# EAGLE design PIC32 (EAGLE 5.12)
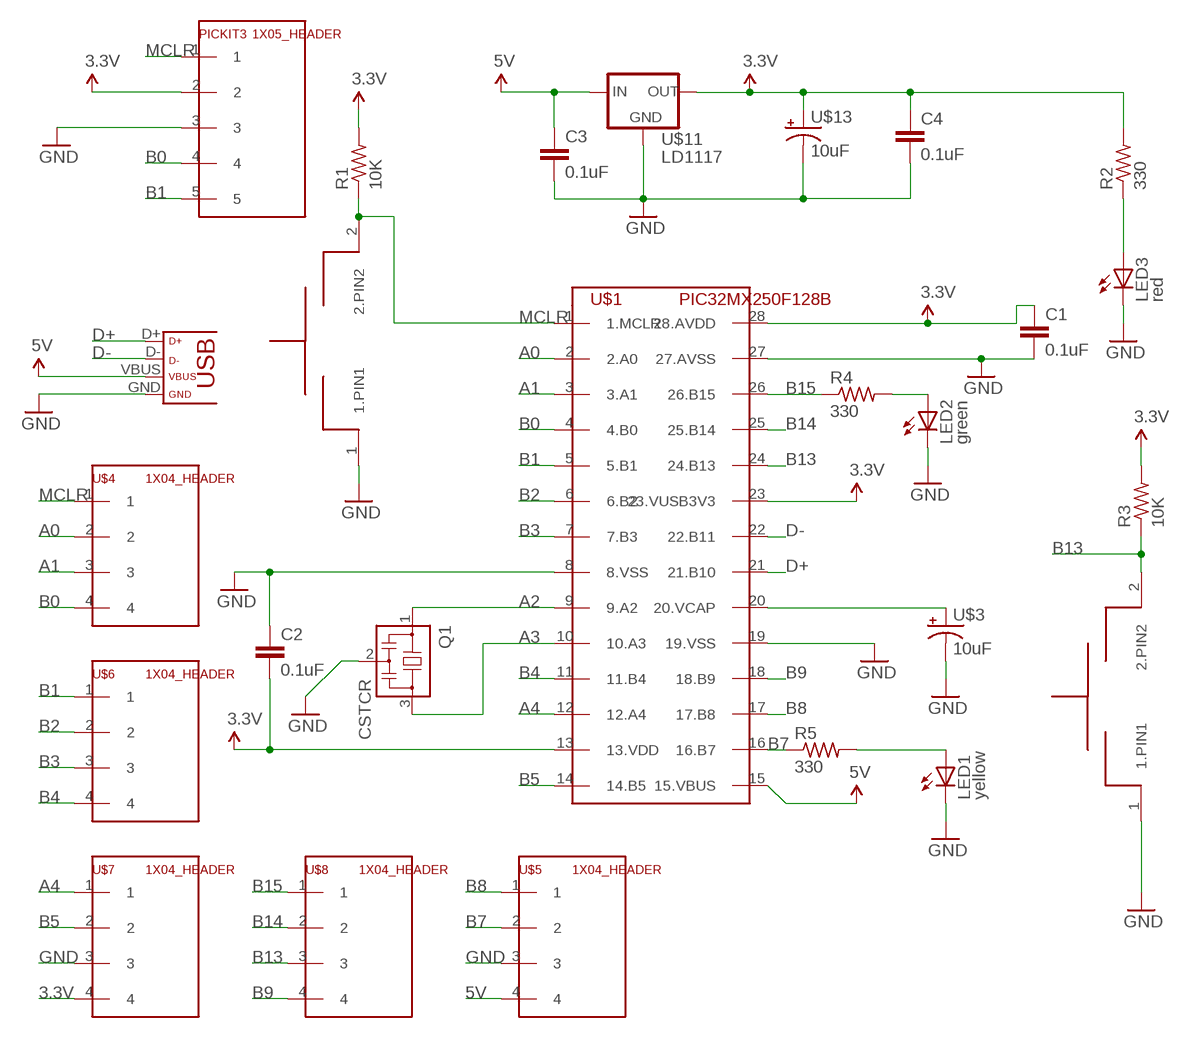
[diagram p0: schematic, sheet 1]

## Parts
C1  0.1uF  C-EU025-030X050  [C025-030X050]
C2  0.1uF  C-EU025-030X050  [C025-030X050]
C3  0.1uF  C-EU025-030X050  [C025-030X050]
C4  0.1uF  C-EU025-030X050  [C025-030X050]
LED1  yellow  LED3MM  [LED3MM]
LED2  green  LED3MM  [LED3MM]
LED3  red  LED3MM  [LED3MM]
PICKIT3  1X05_HEADER  [1X05]
Q1  CSTCR  [RESONATOR]
R1  10K  R-US_0309/12  [0309/12]
R2  330  R-US_0309/12  [0309/12]
R3  10K  R-US_0309/12  [0309/12]
R4  330  R-US_0309/12  [0309/12]
R5  330  R-US_0309/12  [0309/12]
U$1  PIC32MX250F128B  [DIL28-3]
U$3  10uF  CAP_POL  [CAP_POL_D]
U$4  1X04_HEADER  [1X04]
U$5  1X04_HEADER  [1X04]
U$6  1X04_HEADER  [1X04]
U$7  1X04_HEADER  [1X04]
U$8  1X04_HEADER  [1X04]
U$9  USB  [USB-MINIB]
U$11  LD1117  [TO220]
U$13  10uF  CAP_POL  [CAP_POL_D]
U$14  BUTTON  [BUTTON]
U$15  BUTTON  [BUTTON]

## Nets
3.3V: C1.1 C2.2 C4.1 PICKIT3.2 R1.2 R2.2 R3.2 U$1.13(13.VDD) U$1.23(23.VUSB3V3) U$1.28(28.AVDD) U$7.4 U$11.2(OUT) U$13.1(+)
5V: C3.1 U$1.15(15.VBUS) U$5.4 U$9.VBUS U$11.3(IN)
A0: U$1.2(2.A0) U$4.2
A1: U$1.3(3.A1) U$4.3
A2: Q1.1 U$1.9(9.A2)
A3: Q1.3 U$1.10(10.A3)
A4: U$1.12(12.A4) U$7.1
B0: PICKIT3.4 U$1.4(4.B0) U$4.4
B1: PICKIT3.5 U$1.5(5.B1) U$6.1
B2: U$1.6(6.B2) U$6.2
B3: U$1.7(7.B3) U$6.3
B4: U$1.11(11.B4) U$6.4
B5: U$1.14(14.B5) U$7.2
B7: R5.1 U$1.16(16.B7) U$5.2
B8: U$1.17(17.B8) U$5.1
B9: U$1.18(18.B9) U$8.4
B13: R3.1 U$1.24(24.B13) U$8.3 U$15.2(2.PIN2)
B14: U$1.25(25.B14) U$8.2
B15: R4.1 U$1.26(26.B15) U$8.1
D+: U$1.21(21.B10) U$9.D+
D-: U$1.22(22.B11) U$9.D-
GND: C1.2 C2.1 C3.2 C4.2 LED1.K(C) LED2.K(C) LED3.K(C) PICKIT3.3 Q1.2 U$1.8(8.VSS) U$1.19(19.VSS) U$1.27(27.AVSS) U$3.2(-) U$5.3 U$7.3 U$9.GND U$11.1(GND) U$13.2(-) U$14.1(1.PIN1) U$15.1(1.PIN1)
MCLR: PICKIT3.1 R1.1 U$1.1(1.MCLR) U$4.1 U$14.2(2.PIN2)
N$2: LED1.A R5.2
N$4: LED2.A R4.2
N$5: U$1.20(20.VCAP) U$3.1(+)
N$6: LED3.A R2.1

## Library data of the parts
C1-C4 = ME433:C-EU: CAPACITOR, European symbol
LED1-LED3 = led:LED: LED OSRAM: - CHIPLED LG R971, LG N971, LY N971, LG Q971, LY Q971, LO R971, LY R971 LH N974, LH R974 LS Q976, LO Q976, LY Q976 LO Q996 - Hyper CHIPLED LW Q18S LB Q993, LB Q99A, LB R99A - SideLED LS A670, LO A670, LY A670, LG A670, LP A670 LB A673, LV A673, LT A673, LW A673 LH A674 LY A675 LS A676, LA A676, LO A676, LY A676, LW A676 LS A679, LY A679, LG A679 - Hyper Micro SIDELED® LS Y876, LA Y876, LO Y876, LY Y876 LT Y87S - SmartLED LW L88C, LW L88S LB L89C, LB L89S, LG L890 LS L89K, LO L89K, LY L89K LS L896, LA L896, LO L896, LY L896 - TOPLED LS T670, LO T670, LY T670, LG T670, LP T670 LSG T670, LSP T670, LSY T670, LOP T670, LYG T670 LG T671, LOG T671, LSG T671 LB T673, LV T673, LT T673, LW T673 LH T674 LS T676, LA T676, LO T676, LY T676, LB T676, LH T676, LSB T676, LW T676 LB T67C, LV T67C, LT T67C, LS T67K, LO T67K, LY T67K, LW E67C LS E67B, LA E67B, LO E67B, LY E67B, LB E67C, LV E67C, LT E67C LW T67C LS T679, LY T679, LG T679 LS T770, LO T770, LY T770, LG T770, LP T770 LB T773, LV T773, LT T773, LW T773 LH T774 LS E675, LA E675, LY E675, LS T675 LS T776, LA T776, LO T776, LY T776, LB T776 LHGB T686 LT T68C, LB T68C - Hyper Mini TOPLED® LB M676 - Mini TOPLED Santana® LG M470 LS M47K, LO M47K, LY M47K Source: http://www.osram.convergy.de LUXEON: - LUMILED® LXK2-PW12-R00, LXK2-PW12-S00, LXK2-PW14-U00, LXK2-PW14-V00 LXK2-PM12-R00, LXK2-PM12-S00, LXK2-PM14-U00 LXK2-PE12-Q00, LXK2-PE12-R00, LXK2-PE12-S00, LXK2-PE14-T00, LXK2-PE14-U00 LXK2-PB12-K00, LXK2-PB12-L00, LXK2-PB12-M00, LXK2-PB14-N00, LXK2-PB14-P00, LXK2-PB14-Q00 LXK2-PR12-L00, LXK2-PR12-M00, LXK2-PR14-Q00, LXK2-PR14-R00 LXK2-PD12-Q00, LXK2-PD12-R00, LXK2-PD12-S00 LXK2-PH12-R00, LXK2-PH12-S00 LXK2-PL12-P00, LXK2-PL12-Q00, LXK2-PL12-R00 Source: www.luxeon.com KINGBRIGHT: KA-3528ASYC Source: www.kingbright.com
PICKIT3 = ME433:1X05_HEADER
Q1 = ME433:CSTCR: Resonator Source: murata.co.jp
R1-R5 = ME433:R-US_: RESISTOR, American symbol
U$1 = ME433:PIC32MX250F128B
U$3 U$13 = ME433:CAP_POL
U$4-U$8 = ME433:1X04_HEADER
U$9 = ME433:USB
U$11 = ME433:LD1117
U$14 U$15 = ME433:BUTTON

## Board
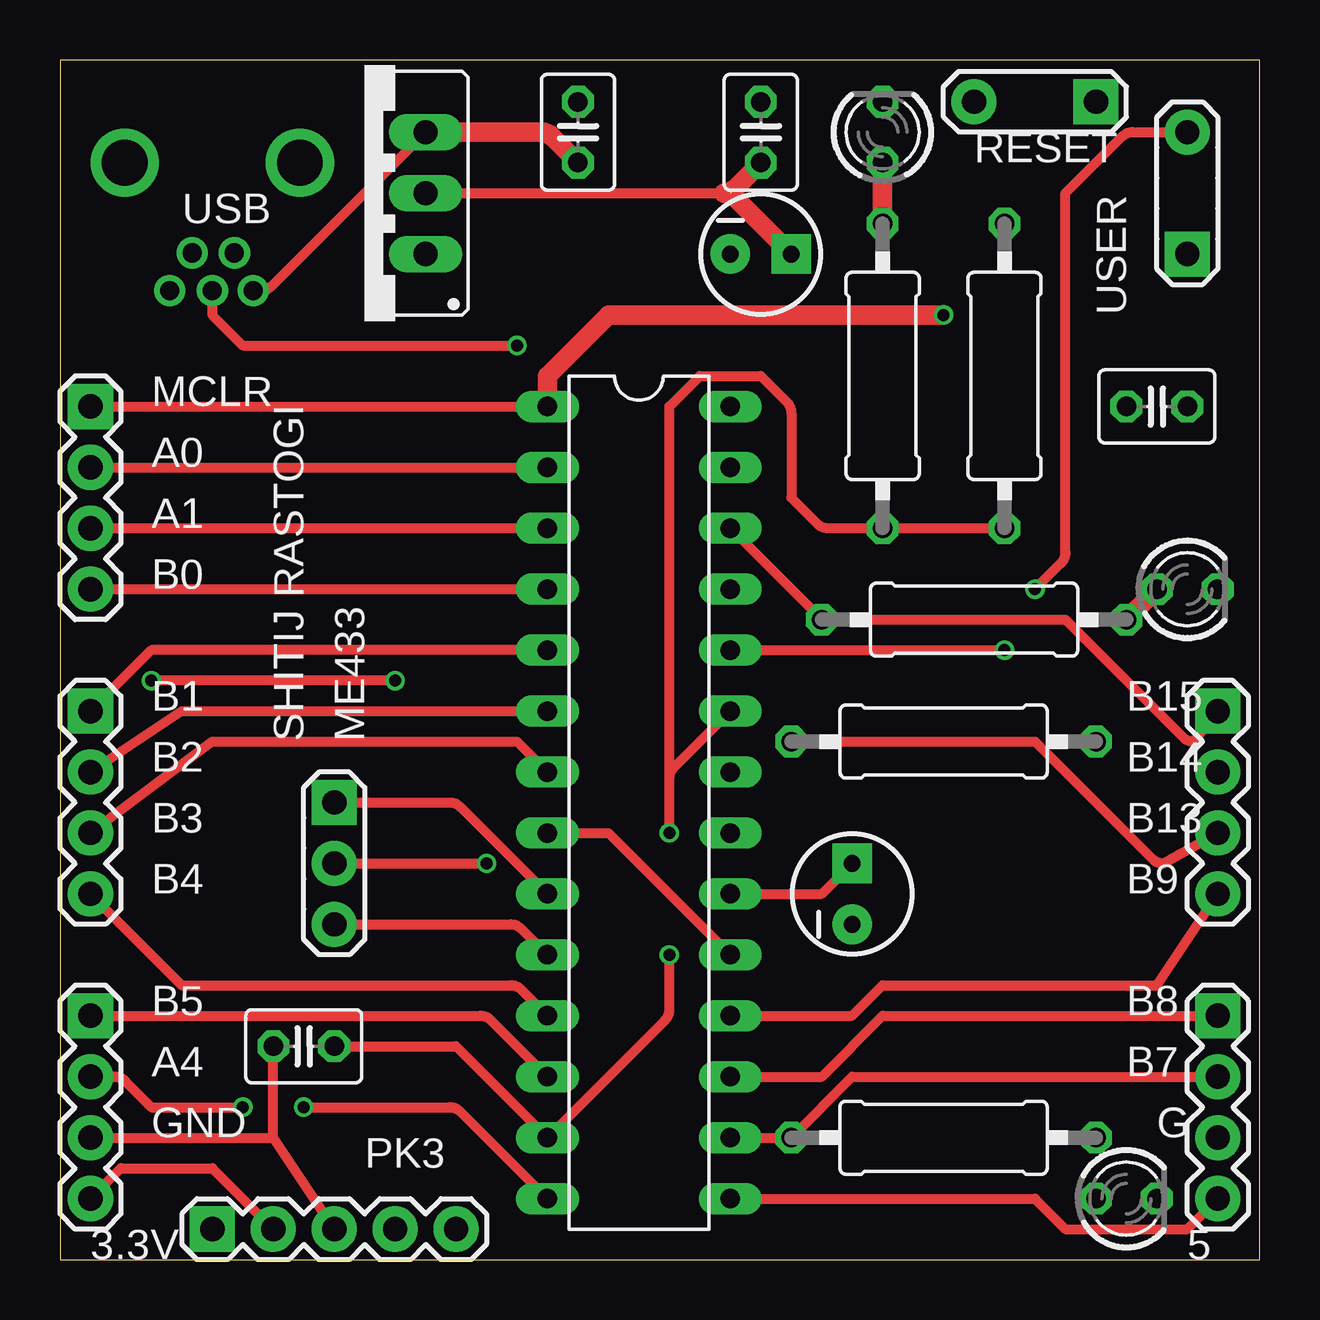
[diagram p1: board, top side]
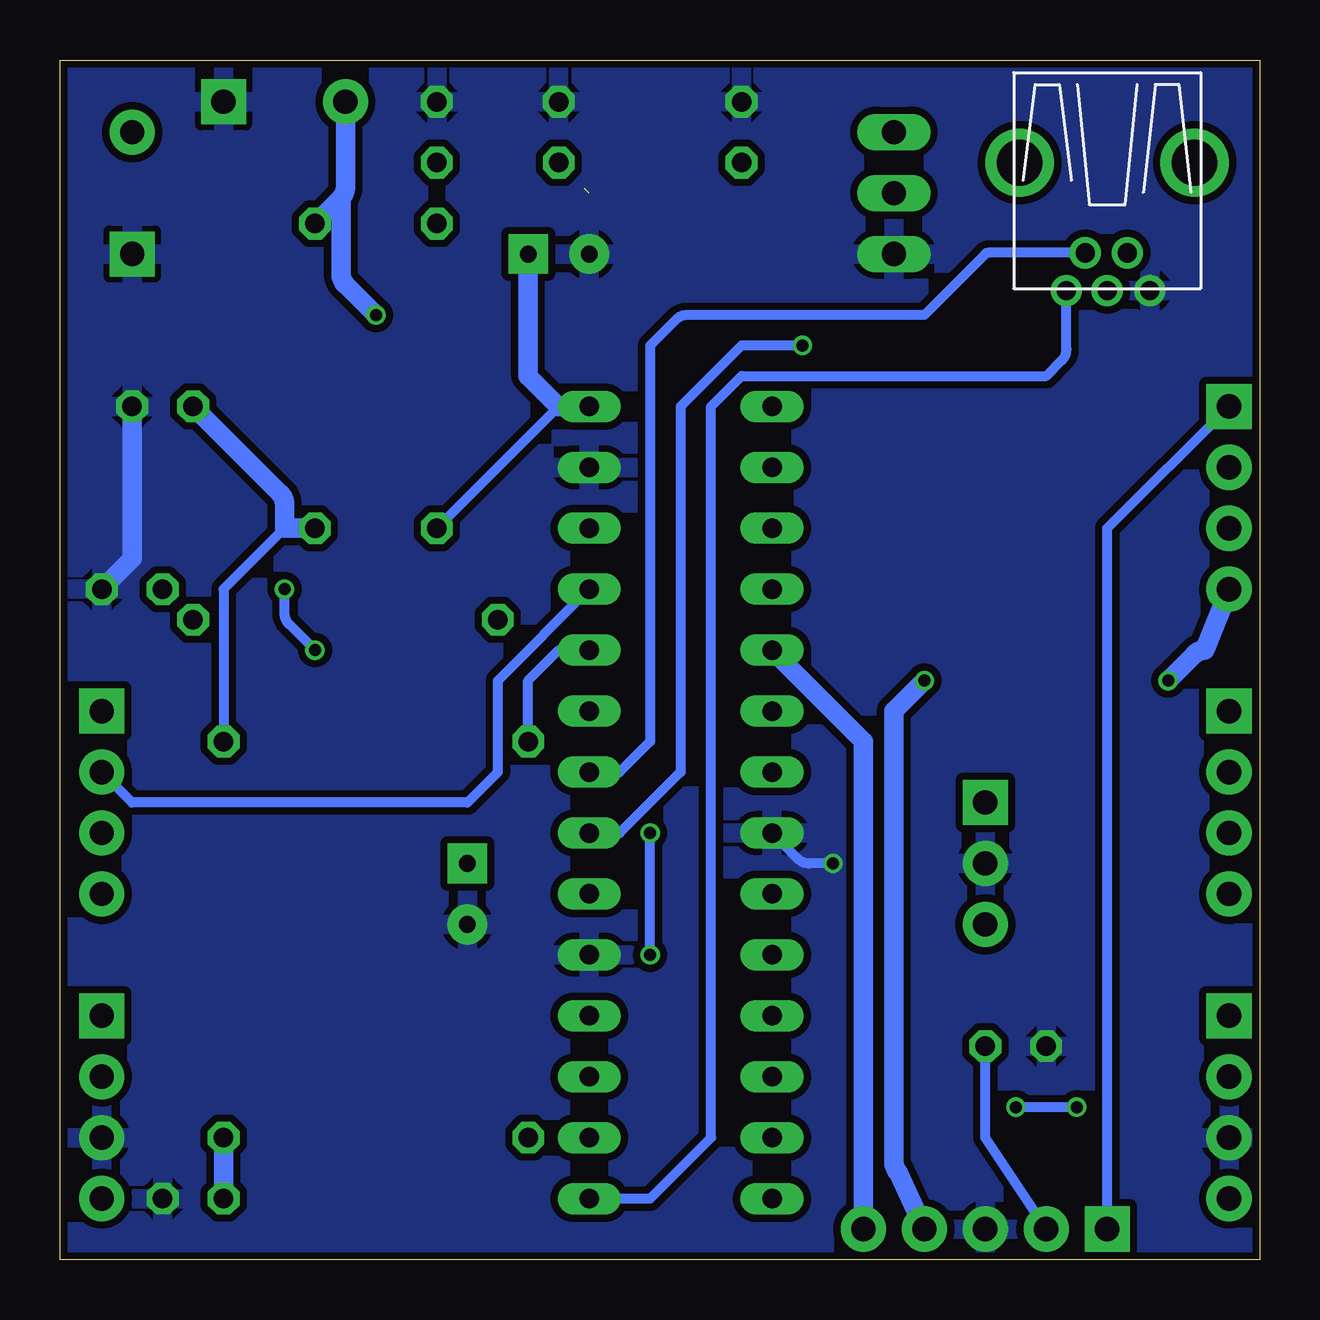
[diagram p2: board, bottom side, seen from below]

Size 50 x 50 mm. Coordinates in mm from the lower left corner, seen from the top.
Outline: 0,0 50,0 50,50 0,50 0,0
Copper layers (1*16): Top 0.035mm / dielectric 1.5mm / Bottom 0.035mm
Design rules "SeeedStudio_2layer_DRU_no_angle_20140221": minimum track width 6mil, minimum drill 12mil, track to track 6mil, track to pad 6mil, pad to pad 6mil, via to via 6mil, smd to smd 0mil, copper to edge 10mil, drill to drill 10mil, minimum pad ring 10mil, minimum via ring 6mil, stop-mask expansion 2mil, vias tented up to drill 100mil, thermal gap 10mil

### Footprints (pad centres in the part's own frame; a part is rotated, then mirrored left to right if it is on the bottom)
C025-030X050 = drill 0.813 octagon: 1 -1.27,0; 2 1.27,0
LED3MM = drill 0.813 octagon: A -1.27,0; K 1.27,0
1X05 = drill 1.016 pad 1.88 square: 1 0,0 | drill 1.016 pad 1.88 round: 2 2.54,0; 3 5.08,0; 4 7.62,0; 5 10.16,0
RESONATOR = drill 1.016 pad 1.88 square: 1 -2.54,0 | drill 1.016 pad 1.88 round: 2 0,0; 3 2.54,0
0309/12 = drill 0.813 octagon: 1 -6.35,0; 2 6.35,0
DIL28-3 = drill 0.813 long: 1 -16.51,-3.81; 2 -13.97,-3.81; 3 -11.43,-3.81; 4 -8.89,-3.81; 5 -6.35,-3.81; 6 -3.81,-3.81; 7 -1.27,-3.81; 8 1.27,-3.81; 9 3.81,-3.81; 10 6.35,-3.81; 11 8.89,-3.81; 12 11.43,-3.81; 13 13.97,-3.81; 14 16.51,-3.81; 15 16.51,3.81; 16 13.97,3.81; 17 11.43,3.81; 18 8.89,3.81; 19 6.35,3.81; 20 3.81,3.81; 21 1.27,3.81; 22 -1.27,3.81; 23 -3.81,3.81; 24 -6.35,3.81; 25 -8.89,3.81; 26 -11.43,3.81; 27 -13.97,3.81; 28 -16.51,3.81
CAP_POL_D = drill 0.7 pad 1.651 square: 1 1.27,0 | drill 0.7 pad 1.651 round: 2 -1.27,0
1X04 = drill 1.016 pad 1.88 square: 1 0,0 | drill 1.016 pad 1.88 round: 2 2.54,0; 3 5.08,0; 4 7.62,0
USB-MINIB = drill 0.8 round: D+ 4.064,0; D- 2.489,0.914; GND 4.064,-1.778; ID 2.489,-0.838; VBUS 4.064,1.702 | drill 1.9 round: P$6 -1.27,-3.65; P$7 -1.27,3.65
TO220 = drill 1.016 long: 1 -2.54,0; 2 0,0; 3 2.54,0
BUTTON = drill 1.016 pad 1.88 square: 1 -2.54,0 | drill 1.016 pad 1.88 round: 2 2.54,0

### Placement (x,y rotation side)
C1  45.72,35.56 0 top
C2  10.16,8.89 0 top
C3  21.59,46.99 90 top
C4  29.21,46.99 90 top
LED1  44.45,2.54 0 top
LED2  46.99,27.94 0 top
LED3  34.29,46.99 90 top
PICKIT3  6.35,1.27 0 top
Q1  11.43,16.51 270 top
R1  39.37,36.83 270 top
R2  34.29,36.83 270 top
R3  36.83,21.59 0 top
R4  38.1,26.67 0 top
R5  36.83,5.08 0 top
U$1  24.13,19.05 270 top
U$3  33.02,15.24 90 top
U$4  1.27,35.56 270 top
U$5  48.26,10.16 270 top
U$6  1.27,22.86 270 top
U$7  1.27,10.16 270 top
U$8  48.26,22.86 270 top
U$9  6.35,44.45 270 top
U$11  15.24,44.45 90 top
U$13  29.21,41.91 0 top
U$14  40.64,48.26 180 top
U$15  46.99,44.45 90 top

### Tracks (layer width: path | path; a pad name or v marks a point on that pad's centre or on a via)
3.3V  (via drill 0.5)  (1 unrouted)
  Top 0.406: C2.2 16.51,8.89 U$1.13 25.21,9.97 arc45 25.4,10.42 v25.4,12.7 | R1.2 R2.2 32.01,30.48 arc-45 31.56,30.67 30.48,31.75 30.48,35.3 arc45 30.29,35.75 29.21,36.83 26.67,36.83 25.4,35.56 v25.4,17.78 25.4,20.06 arc-45 25.59,20.51 U$1.23 | U$11.2 27.68,44.45 | U$7.4 2.54,3.81 6.35,3.81 PICKIT3.2
  Top 0.813: 27.68,44.45 arc45 28.13,44.64 C4.1 | U$13.1 27.94,44.45
  Bottom 0.406: PICKIT3.2 11.43,5.08 C2.2 | R2.2 29.21,35.56 | 40.64,30.48 43.18,27.94 R3.2 | v25.4,12.7 v25.4,17.78
  Bottom 0.813: R1.2 40.64,30.48 40.64,31.49 arc-45 40.83,31.94 C1.1 | U$13.1 30.48,36.83 29.21,35.56 U$1.28
5V
  Top 0.406: U$1.15 40.64,2.54 41.91,1.27 46.99,1.27 U$5.4 | U$9.VBUS 8.37,40.39 arc45 8.82,40.57 U$11.3
  Top 0.813: U$11.3 20.06,46.99 arc-45 20.51,46.8 C3.1
  Bottom 0.406: U$9.VBUS 8.05,37.93 arc45 8.24,37.48 8.89,36.83 21.59,36.83 22.86,35.56 22.86,5.08 25.4,2.54 U$1.15
A0
  Top 0.406: U$4.2 U$1.2
A1
  Top 0.406: U$4.3 U$1.3
A2
  Top 0.406: Q1.1 16.25,19.05 arc-45 16.7,18.86 U$1.9
A3
  Top 0.406: Q1.3 18.79,13.97 arc-45 19.24,13.78 U$1.10
A4
  Top 0.406: U$7.1 17.52,10.16 arc-45 17.97,9.97 U$1.12
B0  (via drill 0.5)
  Top 0.406: U$4.4 U$1.4 | v13.97,24.13 v3.81,24.13
  Bottom 0.813: U$4.4 2.28,25.4 arc-45 2.73,25.21 v3.81,24.13 | v13.97,24.13 15.24,22.86 15.24,4.07 arc-45 15.05,3.62 PICKIT3.4
B1
  Top 0.406: U$6.1 3.81,25.4 U$1.5
  Bottom 0.813: U$1.5 16.51,21.59 PICKIT3.5
B2
  Top 0.406: U$6.2 5.08,22.86 U$1.6
B3
  Top 0.406: U$6.3 6.35,21.59 19.05,21.59 U$1.7
B4
  Top 0.406: U$6.4 5.08,11.43 18.79,11.43 arc-45 19.24,11.24 U$1.11
B5  (via drill 0.5)
  Top 0.406: U$7.2 2.28,7.62 arc-45 2.73,7.43 3.81,6.35 v7.62,6.35 | U$1.14 16.7,6.16 arc45 16.25,6.35 v10.16,6.35
  Bottom 0.406: v7.62,6.35 v10.16,6.35
B7
  Top 0.406: U$1.16 R5.1 33.02,7.62 U$5.2
B8
  Top 0.406: U$1.17 31.75,7.62 34.29,10.16 U$5.1
B9
  Top 0.406: U$1.18 33.02,10.16 34.29,11.43 45.72,11.43 U$8.4
B13  (via drill 0.5)
  Top 0.406: R3.1 40.64,21.59 45.53,16.7 arc45 45.98,16.51 U$8.3 | U$1.24 v39.37,25.4 | v40.64,27.94 41.72,29.02 arc45 41.91,29.47 41.91,44.45 44.26,46.8 arc-45 44.71,46.99 U$15.2
  Bottom 0.406: v39.37,25.4 40.45,26.48 arc45 40.64,26.93 v40.64,27.94 | U$1.24 29.21,25.4 30.48,24.13 R3.1
B14
  Bottom 0.406: U$1.25 31.75,24.13 31.75,20.32 33.02,19.05 46.99,19.05 U$8.2
B15
  Top 0.406: U$8.1 47.25,21.59 arc-45 46.8,21.78 41.91,26.67 R4.1 U$1.26
D+  (via drill 0.5)
  Top 0.406: U$9.D+ 6.35,39.37 7.62,38.1 v19.05,38.1
  Bottom 0.406: v19.05,38.1 21.59,38.1 24.13,35.56 24.13,20.32 26.67,17.78 U$1.21
D-
  Bottom 0.406: U$9.D- 11.31,41.96 arc-45 11.43,41.91 13.97,39.37 23.87,39.37 arc-45 24.32,39.18 25.4,38.1 25.4,21.59 26.67,20.32 U$1.22
GND  (via drill 0.5)
  Top 0.406: Q1.2 v17.78,16.51 | U$7.3 8.89,5.08 | 8.89,5.08 PICKIT3.3 | U$1.8 22.86,17.78 U$1.19 | 8.89,5.08 C2.1
  Bottom 0.406: v17.78,16.51 18.79,16.51 arc45 19.24,16.7 U$1.8
  Bottom 0.813: LED2.K 46.99,29.21 C1.2
  pour Bottom (isolate 0.305): 0,49.53 0,0 50.8,0 50.8,49.53
MCLR  (via drill 0.5)
  Top 0.406: U$4.1 U$1.1
  Top 0.813: v36.83,39.37 22.86,39.37 20.32,36.83 U$1.1
  Bottom 0.406: U$4.1 6.35,30.48 PICKIT3.1
  Bottom 0.813: U$14.2 38.1,44.71 arc45 38.29,44.26 | 38.29,44.26 R1.1 | 38.29,44.26 38.29,41.09 arc-45 38.1,40.64 v36.83,39.37
N$2
  Bottom 0.813: LED1.A R5.2
N$4
  Top 0.813: R4.2 LED2.A
N$5
  Top 0.406: U$1.20 31.75,15.24 U$3.1
N$6
  Top 0.813: R2.1 LED3.A

### Text on the board
tNames: RESET | USB | USER | MCLR | A0 | A1 | B0 | B1 | B15 | SHITIJ RASTOGI | ME433 | B2 | B14 | B3 | B13 | B4 | B9 | B5 | B8 | A4 | B7 | GND | G | PK3 | 3.3V | 5